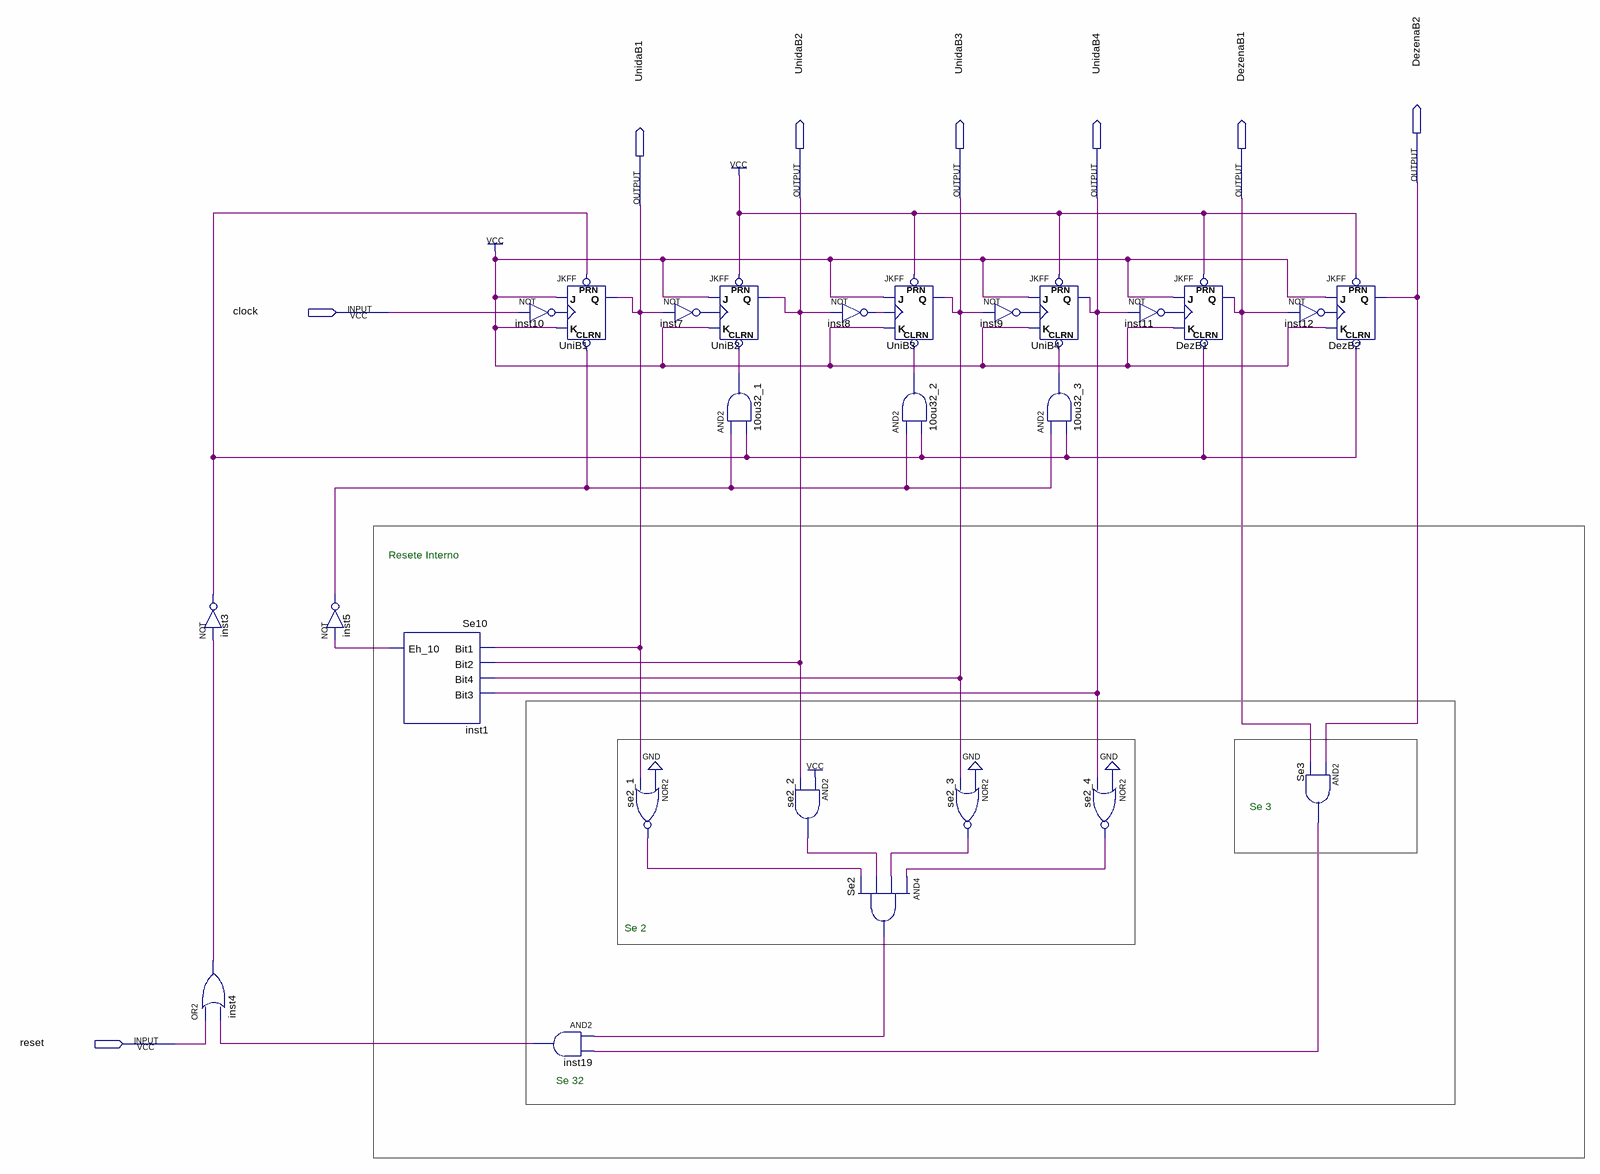
[diagram p0: schematic sheet]
// Quartus schematic contador31.bdf as structural Verilog: 26 symbols, 8 pins
module contador31 (
  input  clock,
  input  reset,
  output DezenaB2,
  output UnidaB2,
  output UnidaB3,
  output UnidaB4,
  output DezenaB1,
  output UnidaB1
);

  wire inst1_eh_10, inst3_out, inst4_out, inst5_out, inst7_out, inst8_out, inst9_out, inst11_out, inst19_out,
       n10ou32_1_out, n10ou32_2_out, n10ou32_3_out, se2_1_out, se2_2_out, se2_3_out, se2_4_out, Se2_out,
       Se3_out;

  not inst3 (inst3_out, inst4_out);
  or inst4 (inst4_out, reset, inst19_out);
  not inst5 (inst5_out, inst1_eh_10);
  Se10 inst1 (.Bit1(UnidaB1), .Bit2(UnidaB2), .Bit4(UnidaB3), .Bit3(UnidaB4), .Eh_10(inst1_eh_10));
  // NOT inst10 has open pins: IN=clock, OUT=open
  and inst19 (inst19_out, Se2_out, Se3_out);
  JKFF UniB1 (.PRN(inst3_out), .CLRN(inst5_out), .K(1'b1), .J(1'b1), .Q(UnidaB1));  // open: CLK
  not inst7 (inst7_out, UnidaB1);
  nor se2_1 (se2_1_out, 1'b0, UnidaB1);
  JKFF UniB2 (.PRN(1'b1), .CLRN(n10ou32_1_out), .K(1'b1), .J(1'b1), .CLK(inst7_out), .Q(UnidaB2));
  and u_10ou32_1 (n10ou32_1_out, inst5_out, inst3_out);
  and se2_2 (se2_2_out, 1'b1, UnidaB2);
  not inst8 (inst8_out, UnidaB2);
  and Se2 (Se2_out, se2_4_out, se2_3_out, se2_2_out, se2_1_out);
  JKFF UniB3 (.PRN(1'b1), .CLRN(n10ou32_2_out), .K(1'b1), .J(1'b1), .CLK(inst8_out), .Q(UnidaB3));
  and u_10ou32_2 (n10ou32_2_out, inst5_out, inst3_out);
  nor se2_3 (se2_3_out, 1'b0, UnidaB3);
  JKFF UniB4 (.PRN(1'b1), .CLRN(n10ou32_3_out), .K(1'b1), .J(1'b1), .CLK(inst9_out), .Q(UnidaB4));
  not inst9 (inst9_out, UnidaB3);
  and u_10ou32_3 (n10ou32_3_out, inst5_out, inst3_out);
  nor se2_4 (se2_4_out, 1'b0, UnidaB4);
  not inst11 (inst11_out, UnidaB4);
  JKFF DezB1 (.PRN(1'b1), .CLRN(inst3_out), .K(1'b1), .J(1'b1), .CLK(inst11_out), .Q(DezenaB1));
  JKFF DezB2 (.PRN(1'b1), .CLRN(inst3_out), .K(1'b1), .J(1'b1), .Q(DezenaB2));  // open: CLK
  // NOT inst12 has open pins: IN=DezenaB1, OUT=open
  and Se3 (Se3_out, DezenaB2, DezenaB1);

  // Notes on the sheet:
  //   Resete Interno
  //   Se 3
  //   Se 2
  //   Se 32
endmodule
